# Altium schematic sheet RS485.SchDoc
size 420 x 297 mm; SheetNumber: 5; SheetTotal: 7
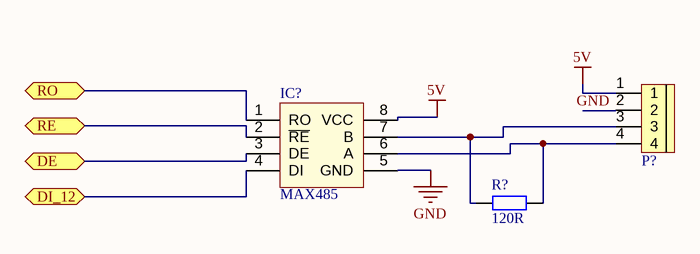
[diagram p0: RS485.SchDoc]

## Parts
IC?  MAX485  [DIP8/W0.3]
P?  CON 4 EDG5.08  [CON 4 4EDG5.08]  (value not drawn)
R?  120R  [tro smd 0805]

## Ports
DE (bidir), DI_12 (bidir), RE (bidir), RO (bidir)

## Nets
5V: IC?.8(VCC) P?.1
GND: IC?.5(GND)
DE: IC?.3(DE) ; port DE
DI_12: IC?.4(DI) ; port DI_12
RE: IC?.2(~{RE}) ; port RE
RO: IC?.1(RO) ; port RO
NetIC?_6: IC?.6(A) P?.4 R?.2
NetIC?_7: IC?.7(B) P?.3 R?.1

Not connected (* = marked no-connect by the designer): P? 2

## Notes on the sheet
- Labels drawn without touching a wire or pin: GND
- THIS DOCUMENT AND THE DATA DISCLOSED HEREIN OR
- HEREWITH IS THE PROPERTY OF ALTIUM LIMITED AND MAY
- DWG NO:
- REVISION
- REV:
- DESCRIPTION
- DATE
- APPROVED
- BE FREELY DISTRIBUTED IN WHOLE. NO RIGHTS ARE
- RESERVED OR EXPRESS OR IMPLIED WARANTEE GIVEN.
- ENG:
- APPROVALS
- PROJECT
- DSN:
- CHK:
- REFERENCE DOCUMENTS
- PROJECT REVISION:
- TITLE
- DOCUMENT REVISION:
- DESIGN ITEM:
- BOM:
- FAB DWG:
- PCB DWG:
- ASSY DWG:
- SCALE:
- A3
- SIZE
- CAGE CODE
- FILE NAME
- DWG NO.
- SHEET
- OF
- REV

## Library data of the parts
IC? = MAX485: RS232 - RS485 (Same sn75176)
P? = CON 4 EDG5.08: Cắm; Ten_Linh_Kien: CON 4 2EDG5.08-4P 5.08MM ( Xanh Cong); Ma_Hang: MH000979; Don_Vi: Con; Ghi_Chu: *; Kieu_Chan: *; Chung_Loai: Cắm
R? = Tro 0805 5% 120R: Dán; Don_Vi: Con; So_Chan: 2; Ten_Linh_Kien: Trở 0805 5% 120R; Ma_Hang: MH005253; Chung_Loai: Dán; Kieu_Chan: *